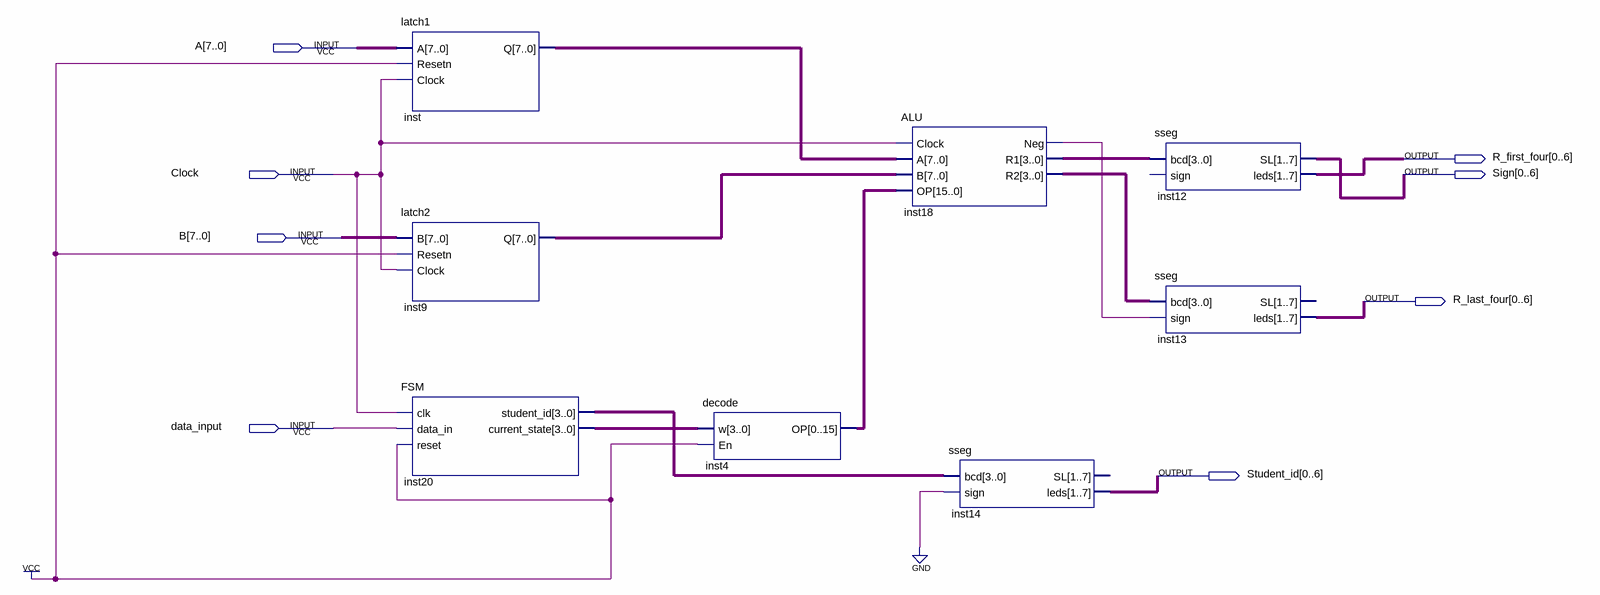
[diagram p0: schematic sheet]
// Quartus schematic ALU1.bdf as structural Verilog: 8 symbols, 8 pins
module ALU1 (
  input  [7:0] A,
  input  Clock,
  input  [7:0] B,
  input  data_input,
  output [0:6] R_first_four,
  output [0:6] Sign,
  output [0:6] R_last_four,
  output [0:6] Student_id
);

  wire inst18_neg;
  wire [3:0] inst18_r1, inst18_r2, inst20_current_state, inst20_student_id;
  wire [7:0] inst9_q, inst_q;
  wire [15:0] inst4_op;

  latch1 inst (.A(A), .Resetn(1'b1), .Clock(Clock), .Q(inst_q));
  latch2 inst9 (.B(B), .Resetn(1'b1), .Clock(Clock), .Q(inst9_q));
  FSM inst20 (
    .clk(Clock), .data_in(data_input), .reset(1'b1), .student_id(inst20_student_id),
    .current_state(inst20_current_state));
  decode inst4 (.w(inst20_current_state), .En(1'b1), .OP(inst4_op));
  ALU inst18 (.Clock(Clock), .A(inst_q), .B(inst9_q), .OP(inst4_op), .Neg(inst18_neg), .R1(inst18_r1), .R2(inst18_r2));
  sseg inst14 (.bcd(inst20_student_id), .sign(1'b0), .leds(Student_id));  // open: SL
  sseg inst12 (.bcd(inst18_r1), .SL(Sign), .leds(R_first_four));  // open: sign
  sseg inst13 (.bcd(inst18_r2), .sign(inst18_neg), .leds(R_last_four));  // open: SL
endmodule
